# EAGLE design BackPlane (EAGLE 9.6.2)
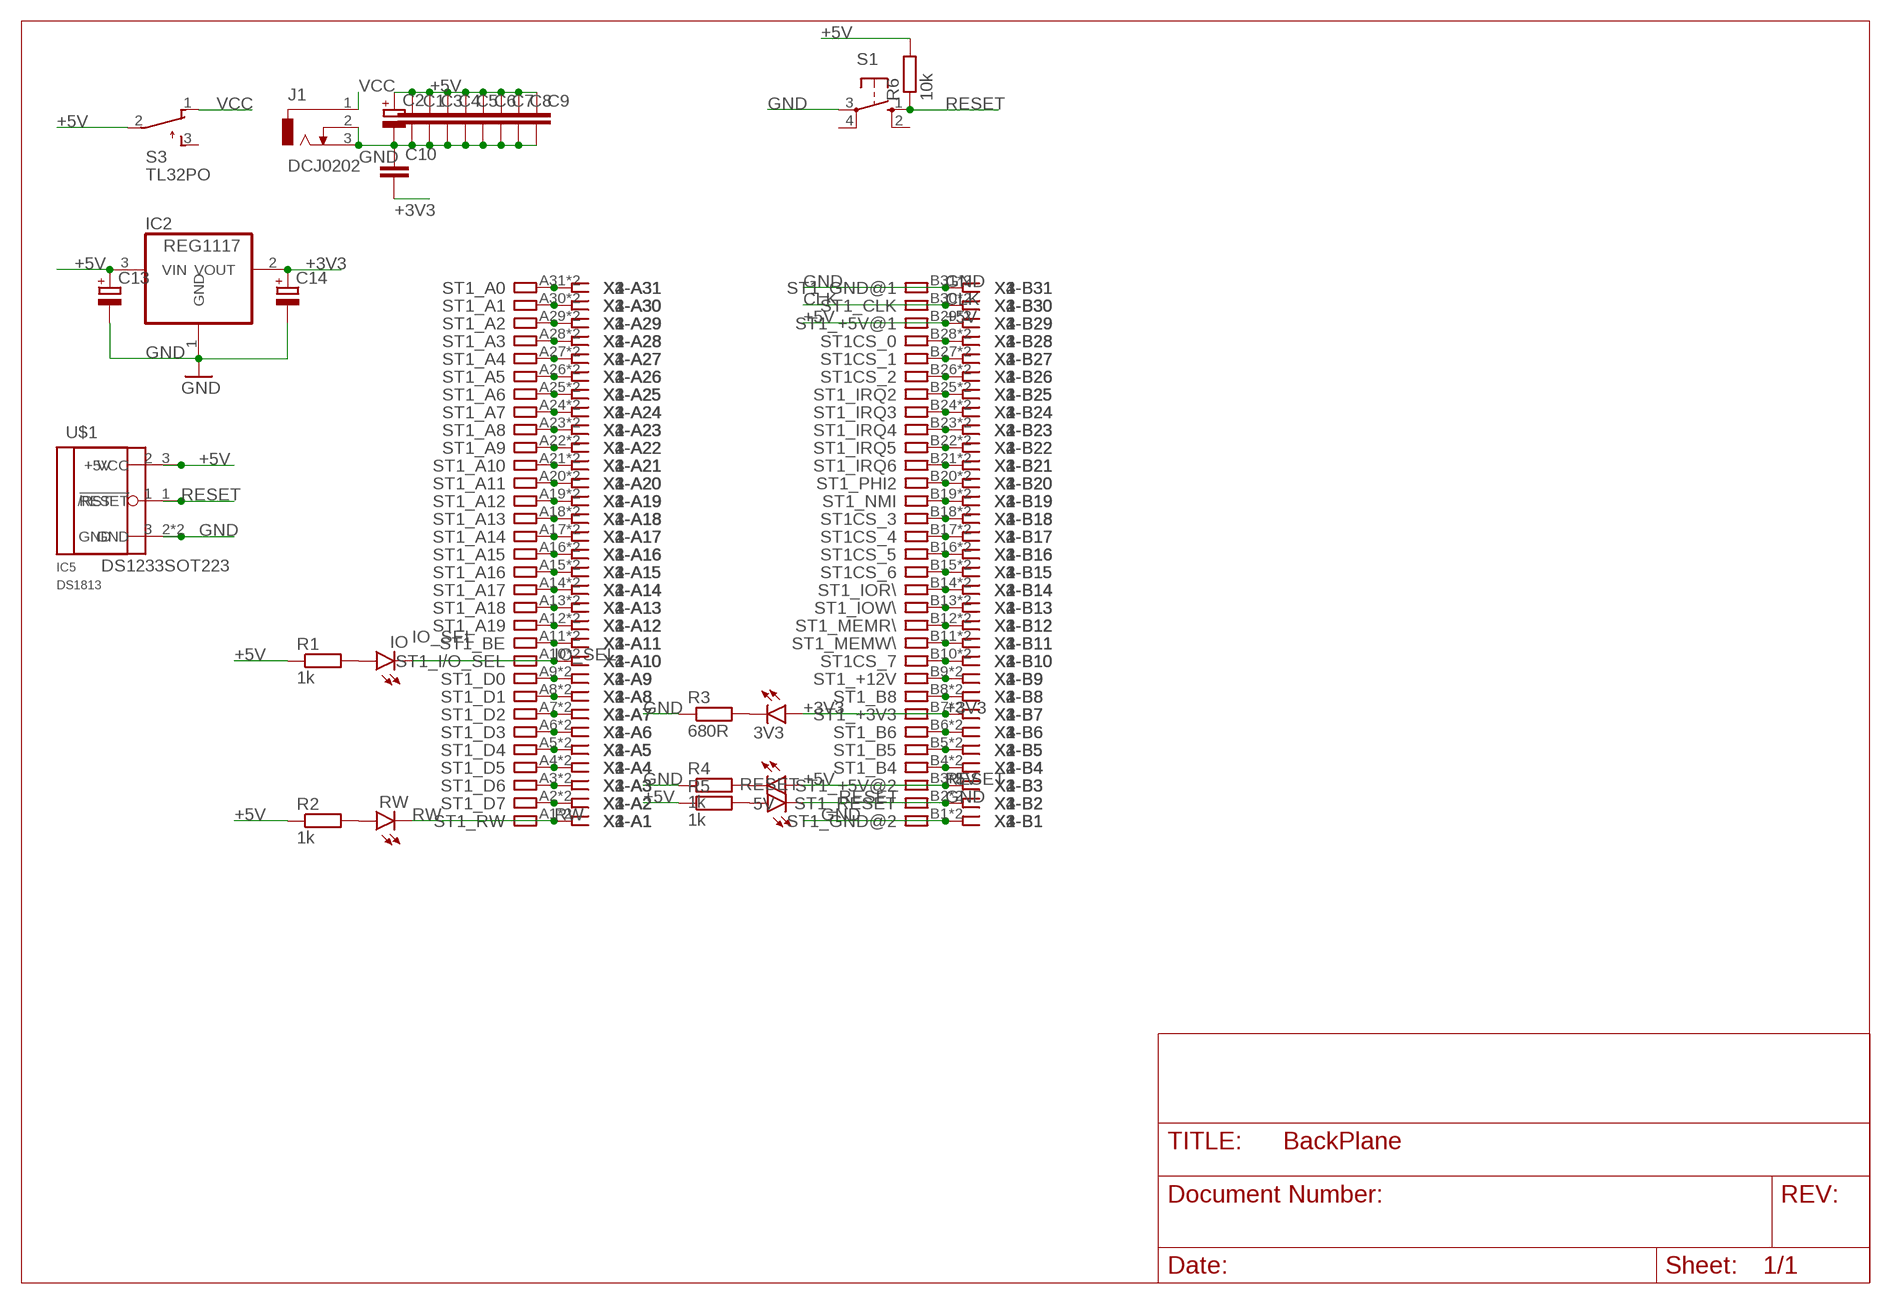
[diagram p0: schematic, sheet 1]

## Parts
3V3  LED3MM  [LED3MM]
5V  LED3MM  [LED3MM]
C1  C-EU050-024X044  [C050-024X044]
C2  CPOL-EUE3.5-8  [E3,5-8]
C3  C-EU050-024X044  [C050-024X044]
C4  C-EU050-024X044  [C050-024X044]
C5  C-EU050-024X044  [C050-024X044]
C6  C-EU050-024X044  [C050-024X044]
C7  C-EU050-024X044  [C050-024X044]
C8  C-EU050-024X044  [C050-024X044]
C9  C-EU050-024X044  [C050-024X044]
C10  C-EU025-024X044  [C025-024X044]
C13  CPOL-EUE2.5-5  [E2,5-5]
C14  CPOL-EUE2.5-5  [E2,5-5]
IC2  REG1117  [SOT223]
IC5  DS1813  [TO-92]
IO  LED3MM  [LED3MM]
J1  DCJ0202  [DCJ0202]
R1  1k  R-EU_0207/7  [0207/7]
R2  1k  R-EU_0207/7  [0207/7]
R3  680R  R-EU_0207/7  [0207/7]
R4  1k  R-EU_0207/7  [0207/7]
R5  1k  R-EU_0207/7  [0207/7]
R6  10k  R-EU_0207/7  [0207/7]
RESET  LED3MM  [LED3MM]
RW  LED3MM  [LED3MM]
S1  10-XX  [B3F-10XX]
S3  TL32PO  [TL3XPO]
ST1  IBM8BIT_ISA  [APP_2X32_DOUBLE]
U$1  DS1233SOT223  [SOT223]
X1  ISA-SLOT  [ISA-8]
X2  ISA-SLOT  [ISA-8]
X3  ISA-SLOT  [ISA-8]
X4  ISA-SLOT  [ISA-8]

## Nets
+3V3: 3V3.A C10.2 C14.+ IC2.2(VOUT) ST1.B7 ST1.B38 X1.B7 X2.B7 X3.B7 X4.B7
+5V: 5V.A C1.1 C2.+ C3.1 C4.1 C5.1 C6.1 C7.1 C8.1 C9.1 C13.+ IC2.3(VIN) IC5.2(+5V) R1.1 R2.1 R5.1 R6.2 S3.2(P) ST1.B3 ST1.B29 ST1.B34 ST1.B60 U$1.3(VCC) X1.B3 X1.B29 X2.B3 X2.B29 X3.B3 X3.B29 X4.B3 X4.B29
CLK: ST1.B30 ST1.B61 X1.B30 X2.B30 X3.B30 X4.B30
GND: C1.2 C2.- C3.2 C4.2 C5.2 C6.2 C7.2 C8.2 C9.2 C10.1 C13.- C14.- IC2.1(GND) IC5.3(GND) J1.2 J1.3 R3.1 R4.1 S1.3(P) ST1.B1 ST1.B31 ST1.B32 ST1.B62 U$1.2(GND) U$1.4(GND) X1.B1 X1.B31 X2.B1 X2.B31 X3.B1 X3.B31 X4.B1 X4.B31
IO_SEL: IO.K(C) ST1.A10 ST1.A41 X1.A10 X2.A10 X3.A10 X4.A10
N$1: IO.A R1.2
N$2: ST1.A2 ST1.A33 X1.A2 X2.A2 X3.A2 X4.A2
N$3: ST1.A3 ST1.A34 X1.A3 X2.A3 X3.A3 X4.A3
N$4: ST1.A4 ST1.A35 X1.A4 X2.A4 X3.A4 X4.A4
N$5: ST1.A5 ST1.A36 X1.A5 X2.A5 X3.A5 X4.A5
N$6: ST1.A6 ST1.A37 X1.A6 X2.A6 X3.A6 X4.A6
N$7: ST1.A7 ST1.A38 X1.A7 X2.A7 X3.A7 X4.A7
N$8: ST1.A8 ST1.A39 X1.A8 X2.A8 X3.A8 X4.A8
N$9: ST1.A9 ST1.A40 X1.A9 X2.A9 X3.A9 X4.A9
N$10: R2.2 RW.A
N$12: ST1.A11 ST1.A42 X1.A11 X2.A11 X3.A11 X4.A11
N$13: ST1.A12 ST1.A43 X1.A12 X2.A12 X3.A12 X4.A12
N$14: ST1.A13 ST1.A44 X1.A13 X2.A13 X3.A13 X4.A13
N$15: ST1.A14 ST1.A45 X1.A14 X2.A14 X3.A14 X4.A14
N$16: ST1.A15 ST1.A46 X1.A15 X2.A15 X3.A15 X4.A15
N$17: ST1.A16 ST1.A47 X1.A16 X2.A16 X3.A16 X4.A16
N$18: ST1.A17 ST1.A48 X1.A17 X2.A17 X3.A17 X4.A17
N$19: ST1.A18 ST1.A49 X1.A18 X2.A18 X3.A18 X4.A18
N$20: ST1.A19 ST1.A50 X1.A19 X2.A19 X3.A19 X4.A19
N$21: ST1.A20 ST1.A51 X1.A20 X2.A20 X3.A20 X4.A20
N$22: ST1.A21 ST1.A52 X1.A21 X2.A21 X3.A21 X4.A21
N$23: ST1.A22 ST1.A53 X1.A22 X2.A22 X3.A22 X4.A22
N$24: ST1.A23 ST1.A54 X1.A23 X2.A23 X3.A23 X4.A23
N$25: ST1.A24 ST1.A55 X1.A24 X2.A24 X3.A24 X4.A24
N$26: ST1.A25 ST1.A56 X1.A25 X2.A25 X3.A25 X4.A25
N$27: ST1.A26 ST1.A57 X1.A26 X2.A26 X3.A26 X4.A26
N$28: ST1.A27 ST1.A58 X1.A27 X2.A27 X3.A27 X4.A27
N$29: ST1.A28 ST1.A59 X1.A28 X2.A28 X3.A28 X4.A28
N$30: ST1.A29 ST1.A60 X1.A29 X2.A29 X3.A29 X4.A29
N$31: ST1.A30 ST1.A61 X1.A30 X2.A30 X3.A30 X4.A30
N$32: ST1.A31 ST1.A62 X1.A31 X2.A31 X3.A31 X4.A31
N$35: ST1.B4 ST1.B35 X1.B4 X2.B4 X3.B4 X4.B4
N$36: ST1.B5 ST1.B36 X1.B5 X2.B5 X3.B5 X4.B5
N$37: ST1.B6 ST1.B37 X1.B6 X2.B6 X3.B6 X4.B6
N$39: ST1.B8 ST1.B39 X1.B8 X2.B8 X3.B8 X4.B8
N$40: ST1.B9 ST1.B40 X1.B9 X2.B9 X3.B9 X4.B9
N$41: ST1.B10 ST1.B41 X1.B10 X2.B10 X3.B10 X4.B10
N$42: ST1.B11 ST1.B42 X1.B11 X2.B11 X3.B11 X4.B11
N$43: ST1.B12 ST1.B43 X1.B12 X2.B12 X3.B12 X4.B12
N$44: ST1.B13 ST1.B44 X1.B13 X2.B13 X3.B13 X4.B13
N$45: ST1.B14 ST1.B45 X1.B14 X2.B14 X3.B14 X4.B14
N$46: ST1.B15 ST1.B46 X1.B15 X2.B15 X3.B15 X4.B15
N$47: ST1.B16 ST1.B47 X1.B16 X2.B16 X3.B16 X4.B16
N$48: ST1.B17 ST1.B48 X1.B17 X2.B17 X3.B17 X4.B17
N$49: ST1.B18 ST1.B49 X1.B18 X2.B18 X3.B18 X4.B18
N$50: ST1.B19 ST1.B50 X1.B19 X2.B19 X3.B19 X4.B19
N$51: ST1.B20 ST1.B51 X1.B20 X2.B20 X3.B20 X4.B20
N$52: ST1.B21 ST1.B52 X1.B21 X2.B21 X3.B21 X4.B21
N$53: ST1.B22 ST1.B53 X1.B22 X2.B22 X3.B22 X4.B22
N$54: ST1.B23 ST1.B54 X1.B23 X2.B23 X3.B23 X4.B23
N$55: ST1.B24 ST1.B55 X1.B24 X2.B24 X3.B24 X4.B24
N$56: ST1.B25 ST1.B56 X1.B25 X2.B25 X3.B25 X4.B25
N$57: ST1.B26 ST1.B57 X1.B26 X2.B26 X3.B26 X4.B26
N$58: ST1.B27 ST1.B58 X1.B27 X2.B27 X3.B27 X4.B27
N$59: ST1.B28 ST1.B59 X1.B28 X2.B28 X3.B28 X4.B28
N$63: 3V3.K(C) R3.2
N$64: 5V.K(C) R4.2
N$68: R5.2 RESET.A
RESET: IC5.1(/RST) R6.1 RESET.K(C) S1.1(S) ST1.B2 ST1.B33 U$1.1(!RESET) X1.B2 X2.B2 X3.B2 X4.B2
RW: RW.K(C) ST1.A1 ST1.A32 X1.A1 X2.A1 X3.A1 X4.A1
VCC: J1.1 S3.1(O)
Unconnected: S1.2(S1) S1.4(P1) S3.3(S)

## Library data of the parts
3V3 5V IO RESET RW = led:LED: LED OSRAM: - CHIPLED LG R971, LG N971, LY N971, LG Q971, LY Q971, LO R971, LY R971 LH N974, LH R974 LS Q976, LO Q976, LY Q976 LO Q996 - Hyper CHIPLED LW Q18S LB Q993, LB Q99A, LB R99A - SideLED LS A670, LO A670, LY A670, LG A670, LP A670 LB A673, LV A673, LT A673, LW A673 LH A674 LY A675 LS A676, LA A676, LO A676, LY A676, LW A676 LS A679, LY A679, LG A679 - Hyper Micro SIDELED® LS Y876, LA Y876, LO Y876, LY Y876 LT Y87S - SmartLED LW L88C, LW L88S LB L89C, LB L89S, LG L890 LS L89K, LO L89K, LY L89K LS L896, LA L896, LO L896, LY L896 - TOPLED LS T670, LO T670, LY T670, LG T670, LP T670 LSG T670, LSP T670, LSY T670, LOP T670, LYG T670 LG T671, LOG T671, LSG T671 LB T673, LV T673, LT T673, LW T673 LH T674 LS T676, LA T676, LO T676, LY T676, LB T676, LH T676, LSB T676, LW T676 LB T67C, LV T67C, LT T67C, LS T67K, LO T67K, LY T67K, LW E67C LS E67B, LA E67B, LO E67B, LY E67B, LB E67C, LV E67C, LT E67C LW T67C LS T679, LY T679, LG T679 LS T770, LO T770, LY T770, LG T770, LP T770 LB T773, LV T773, LT T773, LW T773 LH T774 LS E675, LA E675, LY E675, LS T675 LS T776, LA T776, LO T776, LY T776, LB T776 LHGB T686 LT T68C, LB T68C - Hyper Mini TOPLED® LB M676 - Mini TOPLED Santana® LG M470 LS M47K, LO M47K, LY M47K Source: http://www.osram.convergy.de LUXEON: - LUMILED® LXK2-PW12-R00, LXK2-PW12-S00, LXK2-PW14-U00, LXK2-PW14-V00 LXK2-PM12-R00, LXK2-PM12-S00, LXK2-PM14-U00 LXK2-PE12-Q00, LXK2-PE12-R00, LXK2-PE12-S00, LXK2-PE14-T00, LXK2-PE14-U00 LXK2-PB12-K00, LXK2-PB12-L00, LXK2-PB12-M00, LXK2-PB14-N00, LXK2-PB14-P00, LXK2-PB14-Q00 LXK2-PR12-L00, LXK2-PR12-M00, LXK2-PR14-Q00, LXK2-PR14-R00 LXK2-PD12-Q00, LXK2-PD12-R00, LXK2-PD12-S00 LXK2-PH12-R00, LXK2-PH12-S00 LXK2-PL12-P00, LXK2-PL12-Q00, LXK2-PL12-R00 Source: www.luxeon.com KINGBRIGHT: KA-3528ASYC Source: www.kingbright.com
C1 C3-C10 = rcl:C-EU: CAPACITOR, European symbol; SPICEPREFIX: C
C2 C13 C14 = rcl:CPOL-EU: POLARIZED CAPACITOR, European symbol; SPICEPREFIX: C
IC2 = burr-brown:REG1117: 800mA and 1A Low Dropout (LDO) Positive Regulator 1.8V, 2.5V, 2.85V, 3.3V, 5V, and Adj; MPN: REG1117; OC_FARNELL: 1097566; OC_NEWARK: 14P6981
IC5 = ds1813_revised:DS1813
J1 = con-jack:DCJ0202: DC POWER JACK Source: DCJ0202.pdf; OC_FARNELL: unknown; OC_NEWARK: unknown
R1-R6 = rcl:R-EU_: RESISTOR, European symbol; SPICEPREFIX: R
S1 = switch-omron:10-XX: OMRON SWITCH; MPN: B3F-1000; OC_FARNELL: 176432; OC_NEWARK: 36M3542
S3 = switch:TL32PO: TINY SWITCH ON - MOM Source: http://www2.produktinfo.conrad.com/datenblaetter/700000-724999/705152-da-01-de-Subminiaturschalter_TL_36YO.pdf
ST1 = TiRoRiN_Libs:IBM8BIT_ISA: 8-bit CARD IBM/PC-AT
U$1 = TiRoRiN_Libs:DS1233
X1-X4 = TiRoRiN_Libs:ISA-SLOT: ISA SLOT

## Net classes
0 default: width 0.203 mm, drill 0.66 mm, clearance 0.254 mm
1 power: width 0.203 mm, drill 0.66 mm, clearance 0.254 mm to class 0, clearance 0.381 mm
2 data: width 0.381 mm, drill 0.66 mm, clearance 0.254 mm to class 0, clearance 0.254 mm to class 1, clearance 0.254 mm

## Board
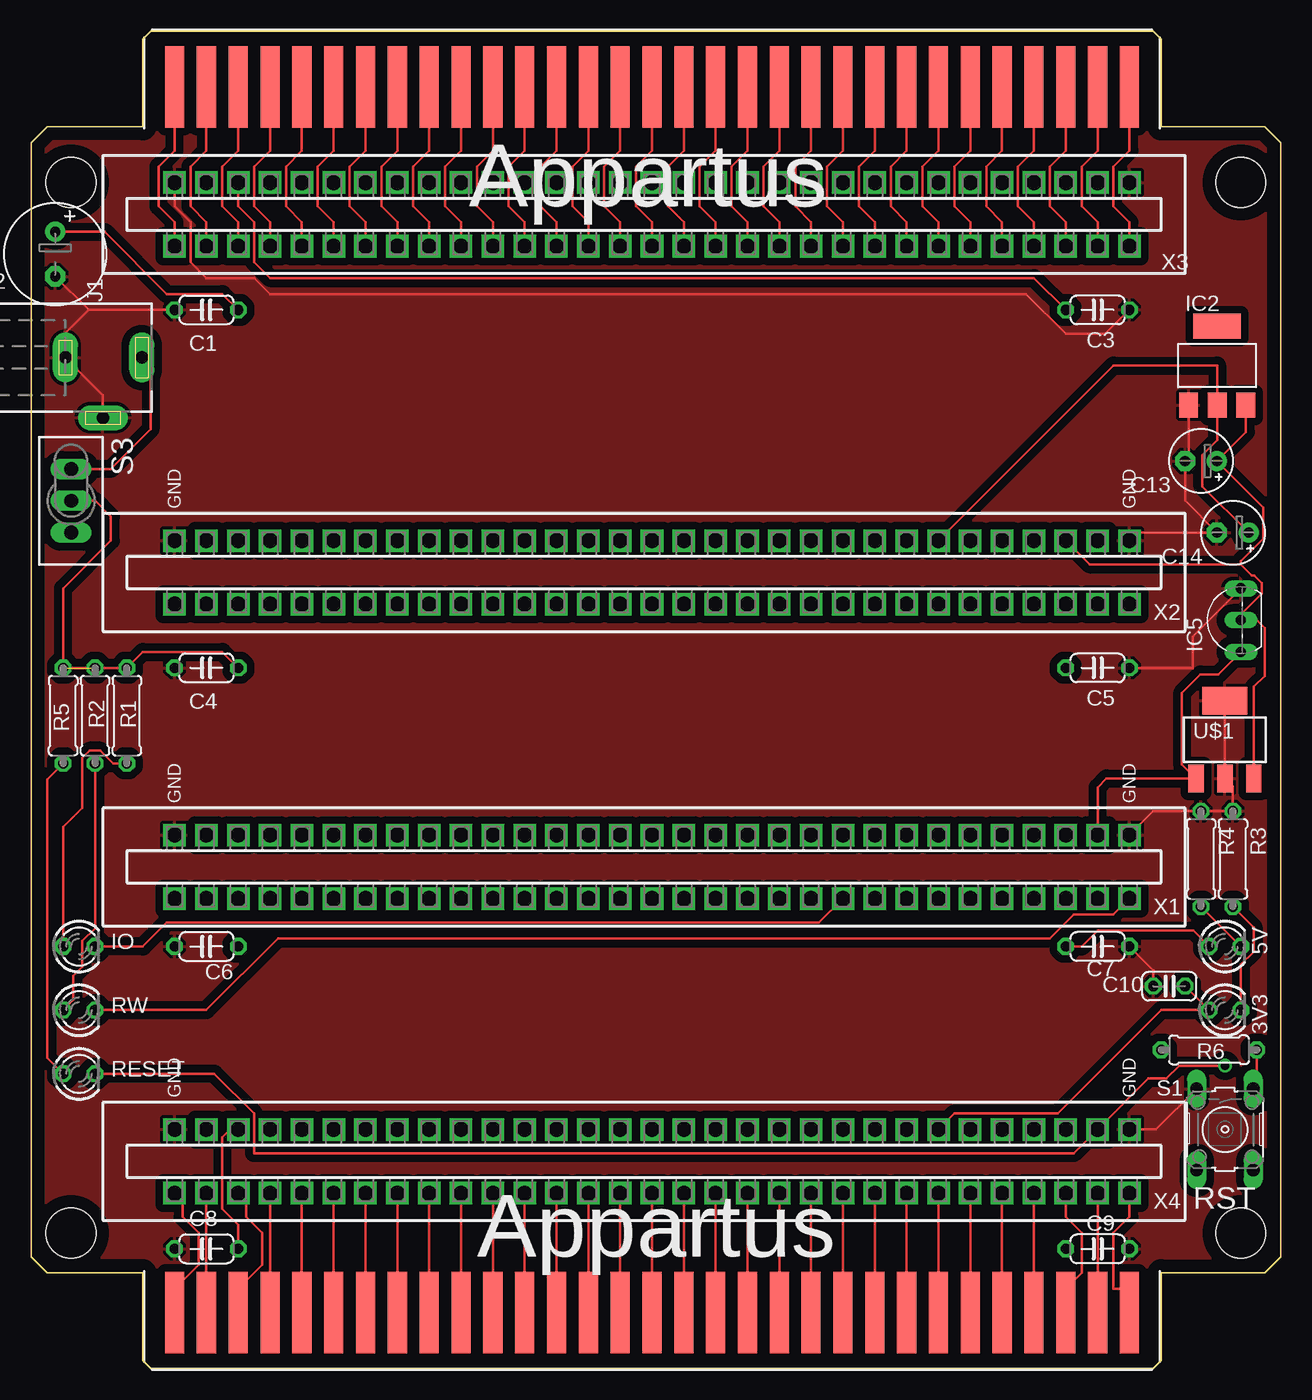
[diagram p1: board, top side]
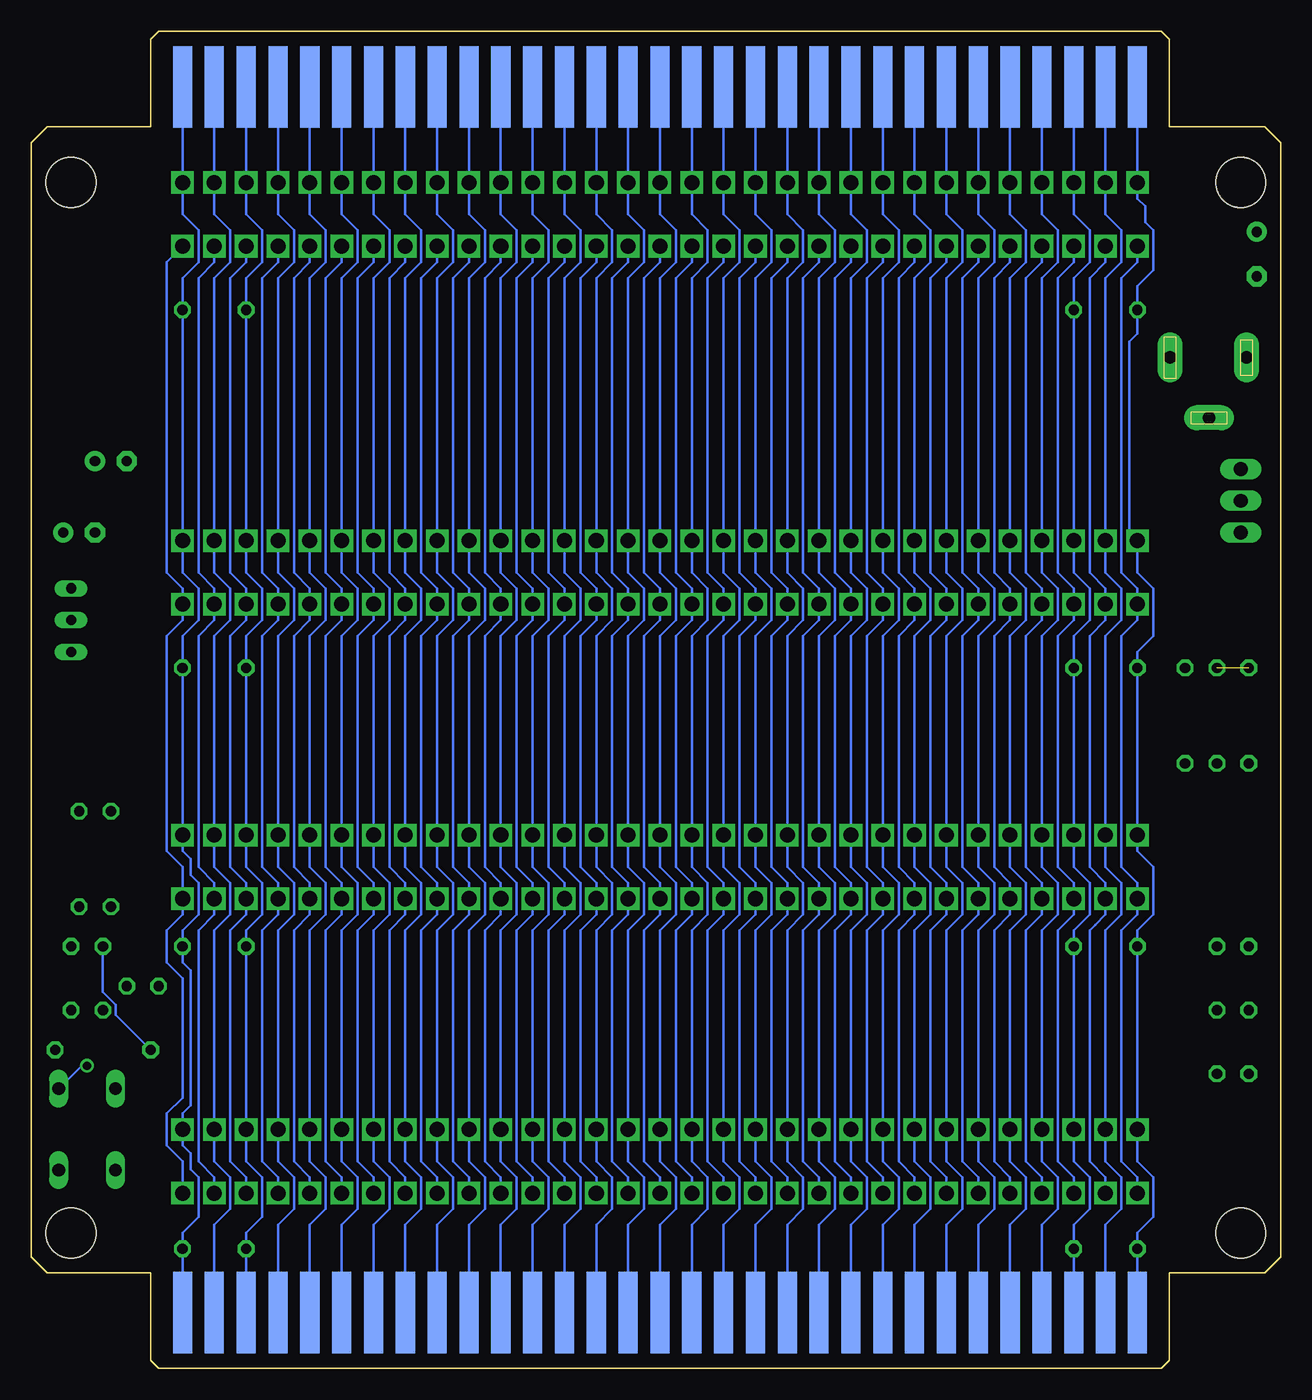
[diagram p2: board, bottom side, seen from below]

Size 99.69 x 106.68 mm. Coordinates in mm from the lower left corner, seen from the top.
Copper layers (1*16): Top 0.035mm / dielectric 1.5mm / Bottom 0.035mm
Design rules "default": minimum track width 6mil, minimum drill 0.35mm, track to track 6mil, track to pad 6mil, pad to pad 6mil, via to via 6mil, smd to smd 6mil, copper to edge 40mil, drill to drill 6mil, minimum pad ring 10mil, minimum via ring 8mil, stop-mask expansion 4mil, vias tented up to drill 0mil, thermal gap 10mil
Holes 4 mm at 3.17,94.61 96.52,94.61 96.52,10.79 3.17,10.79

### Footprints (pad centres in the part's own frame; a part is rotated, then mirrored left to right if it is on the bottom)
LED3MM = drill 0.813 octagon: A -1.27,0; K 1.27,0
C050-024X044 = drill 0.813 octagon: 1 -2.54,0; 2 2.54,0
E3,5-8 = drill 0.813 pad 1.6: + -1.778,0 | drill 0.813 pad 1.6 octagon: - 1.778,0
C025-024X044 = drill 0.813 octagon: 1 -1.27,0; 2 1.27,0
E2,5-5 = drill 0.813 pad 1.6: + -1.27,0 | drill 0.813 pad 1.6 octagon: - 1.27,0
SOT223 = smd 1.499 x 2.007: 1 -2.261,-3.15; 2 0.025,-3.15; 3 2.311,-3.15 | smd 3.81 x 2.007: 4 0,3.15
TO-92 = drill 0.813 long: 1 -2.54,0; 2 0,0; 3 2.54,0
DCJ0202 = drill 1 pad 2 long: 1 0,3.1; 2 4.8,0; 3 0,-3
0207/7 = drill 0.813 octagon: 1 -3.81,0; 2 3.81,0
B3F-10XX = drill 1.016 long: 1 -3.251,2.261; 2 3.251,2.261; 3 -3.251,-2.261; 4 3.251,-2.261
TL3XPO = drill 1.1 pad 1.422 long: 1 -2.54,0; 2 0,0; 3 2.54,0
APP_2X32_DOUBLE = smd 1.524 x 6.477: A1 38.1,-43.18; A2 35.56,-43.18; A3 33.02,-43.18; A4 30.48,-43.18; A5 27.94,-43.18; A6 25.4,-43.18; A7 22.86,-43.18; A8 20.32,-43.18; A9 17.78,-43.18; A10 15.24,-43.18; A11 12.7,-43.18; A12 10.16,-43.18; A13 7.62,-43.18; A14 5.08,-43.18; A15 2.54,-43.18; A16 0,-43.18; A17 -2.54,-43.18; A18 -5.08,-43.18; A19 -7.62,-43.18; A20 -10.16,-43.18; A21 -12.7,-43.18; A22 -15.24,-43.18; A23 -17.78,-43.18; A24 -20.32,-43.18; A25 -22.86,-43.18; A26 -25.4,-43.18; A27 -27.94,-43.18; A28 -30.48,-43.18; A29 -33.02,-43.18; A30 -35.56,-43.18; A31 -38.1,-43.18; A32 38.1,54.61; A33 35.56,54.61; A34 33.02,54.61; A35 30.48,54.61; A36 27.94,54.61; A37 25.4,54.61; A38 22.86,54.61; A39 20.32,54.61; A40 17.78,54.61; A41 15.24,54.61; A42 12.7,54.61; A43 10.16,54.61; A44 7.62,54.61; A45 5.08,54.61; A46 2.54,54.61; A47 0,54.61; A48 -2.54,54.61; A49 -5.08,54.61; A50 -7.62,54.61; A51 -10.16,54.61; A52 -12.7,54.61; A53 -15.24,54.61; A54 -17.78,54.61; A55 -20.32,54.61; A56 -22.86,54.61; A57 -25.4,54.61; A58 -27.94,54.61; A59 -30.48,54.61; A60 -33.02,54.61; A61 -35.56,54.61; A62 -38.1,54.61 | smd 1.524 x 6.477 bottom: B1 38.1,-43.18; B2 35.56,-43.18; B3 33.02,-43.18; B4 30.48,-43.18; B5 27.94,-43.18; B6 25.4,-43.18; B7 22.86,-43.18; B8 20.32,-43.18; B9 17.78,-43.18; B10 15.24,-43.18; B11 12.7,-43.18; B12 10.16,-43.18; B13 7.62,-43.18; B14 5.08,-43.18; B15 2.54,-43.18; B16 0,-43.18; B17 -2.54,-43.18; B18 -5.08,-43.18; B19 -7.62,-43.18; B20 -10.16,-43.18; B21 -12.7,-43.18; B22 -15.24,-43.18; B23 -17.78,-43.18; B24 -20.32,-43.18; B25 -22.86,-43.18; B26 -25.4,-43.18; B27 -27.94,-43.18; B28 -30.48,-43.18; B29 -33.02,-43.18; B30 -35.56,-43.18; B31 -38.1,-43.18; B32 38.1,54.61; B33 35.56,54.61; B34 33.02,54.61; B35 30.48,54.61; B36 27.94,54.61; B37 25.4,54.61; B38 22.86,54.61; B39 20.32,54.61; B40 17.78,54.61; B41 15.24,54.61; B42 12.7,54.61; B43 10.16,54.61; B44 7.62,54.61; B45 5.08,54.61; B46 2.54,54.61; B47 0,54.61; B48 -2.54,54.61; B49 -5.08,54.61; B50 -7.62,54.61; B51 -10.16,54.61; B52 -12.7,54.61; B53 -15.24,54.61; B54 -17.78,54.61; B55 -20.32,54.61; B56 -22.86,54.61; B57 -25.4,54.61; B58 -27.94,54.61; B59 -30.48,54.61; B60 -33.02,54.61; B61 -35.56,54.61; B62 -38.1,54.61
SOT223' = smd 1.219 x 2.235: 1 -2.311,-3.099; 2 0,-3.099; 3 2.311,-3.099 | smd 3.6 x 2.2: 4 0,3.099
ISA-8 = drill 1.2 pad 1.778 square: A1 40.64,-2.54; A2 38.1,-2.54; A3 35.56,-2.54; A4 33.02,-2.54; A5 30.48,-2.54; A6 27.94,-2.54; A7 25.4,-2.54; A8 22.86,-2.54; A9 20.32,-2.54; A10 17.78,-2.54; A11 15.24,-2.54; A12 12.7,-2.54; A13 10.16,-2.54; A14 7.62,-2.54; A15 5.08,-2.54; A16 2.54,-2.54; A17 0,-2.54; A18 -2.54,-2.54; A19 -5.08,-2.54; A20 -7.62,-2.54; A21 -10.16,-2.54; A22 -12.7,-2.54; A23 -15.24,-2.54; A24 -17.78,-2.54; A25 -20.32,-2.54; A26 -22.86,-2.54; A27 -25.4,-2.54; A28 -27.94,-2.54; A29 -30.48,-2.54; A30 -33.02,-2.54; A31 -35.56,-2.54; B1 40.64,2.54; B2 38.1,2.54; B3 35.56,2.54; B4 33.02,2.54; B5 30.48,2.54; B6 27.94,2.54; B7 25.4,2.54; B8 22.86,2.54; B9 20.32,2.54; B10 17.78,2.54; B11 15.24,2.54; B12 12.7,2.54; B13 10.16,2.54; B14 7.62,2.54; B15 5.08,2.54; B16 2.54,2.54; B17 0,2.54; B18 -2.54,2.54; B19 -5.08,2.54; B20 -7.62,2.54; B21 -10.16,2.54; B22 -12.7,2.54; B23 -15.24,2.54; B24 -17.78,2.54; B25 -20.32,2.54; B26 -22.86,2.54; B27 -25.4,2.54; B28 -27.94,2.54; B29 -30.48,2.54; B30 -33.02,2.54; B31 -35.56,2.54

### Placement (x,y rotation side)
3V3  95.25,28.57 0 top
5V  95.25,33.66 0 top
C1  13.97,84.45 180 top
C2  1.9,88.9 270 top
C3  85.09,84.45 0 top
C4  13.97,55.88 180 top
C5  85.09,55.88 0 top
C6  13.97,33.66 180 top
C7  85.09,33.66 0 top
C8  13.97,9.52 180 top
C9  85.09,9.52 0 top
C10  90.81,30.48 0 top
C13  93.34,72.39 180 top
C14  95.88,66.67 180 top
IC2  94.62,80.01 0 top
IC5  96.52,59.69 90 top
IO  3.81,33.66 0 top
J1  5.71,80.64 270 top
R1  7.62,52.07 270 top
R2  5.08,52.07 270 top
R3  95.88,40.64 270 top
R4  93.34,40.64 270 top
R5  2.54,52.07 270 top
R6  93.98,25.4 180 top
RESET  3.81,23.49 0 top
RW  3.81,28.57 0 top
S1  95.25,19.05 270 top
S3  3.17,69.22 270 top
ST1  49.53,47.62 0 top
U$1  DS1233SOT223  [SOT223']  95.25,50.16 0 top
X1  46.99,40 0 top
X2  46.99,63.5 0 top
X3  46.99,92.08 0 top
X4  46.99,16.51 0 top

### Tracks (layer width: path | path; a pad name or v marks a point on that pad's centre or on a via)
+3V3
  Top 0.203: X4.B7 73.66,20.32 81.91,20.32 90.17,28.57 3V3.A C10.2 | X2.B7 86.36,80.01 94.62,80.01 94.64,79.98 IC2.2 94.64,74.05 93.46,72.87 93.46,70.37 C14.+
  Bottom 0.203: ST1.B7 72.39,11.43 71.12,12.7 71.12,15.24 72.39,16.51 X4.B7 72.39,34.92 71.12,36.2 71.12,38.73 72.39,40 X1.B7 72.39,58.42 71.12,59.69 71.12,62.23 72.39,63.5 X2.B7 72.39,87 71.12,88.27 71.12,90.8 72.39,92.08 X3.B7 ST1.B38
+5V  (1 unrouted)
  Top 0.203: 5V.A 92.71,34.92 85.09,34.92 83.82,33.66 C7.1 | C8.1 16.51,11.43 15.24,12.7 15.24,18.41 15.88,19.05 X4.B29 | C4.1 15.24,57.15 8.89,57.15 R1.1 R5.1 2.54,62.23 6.35,66.04 6.35,67.94 5.08,69.22 S3.2 | IC2.3 96.93,74.7 C13.+ 98.31,68.69 98.31,66.2 96.52,64.41 96.52,64.13 | X2.B3 84.46,64.13 96.52,64.13 | 96.52,64.13 97.41,63.25 97.6,63.25 98.2,62.65 98.2,61.81 96.52,60.13 IC5.2 97.79,59.69 98.43,59.05 98.43,55.24 97.56,54.38 U$1.3 | C2.+ 5.84,90.68 10.79,85.72 15.24,85.72 C1.1 | X3.B29 16.51,92.71 17.78,91.44 17.78,88.27 19.05,87 80.01,87 C3.1
  Bottom 0.203: ST1.B3 C9.1 82.55,10.79 81.28,12.06 81.28,15.24 82.55,16.51 X4.B3 C7.1 82.55,34.92 81.28,36.2 81.28,38.73 82.55,40 X1.B3 C5.1 82.55,58.42 81.28,59.69 81.28,62.23 82.55,63.5 X2.B3 C3.1 82.55,87 81.28,88.27 81.28,90.8 82.55,92.08 X3.B3 ST1.B34 | ST1.B29 16.51,11.43 15.24,12.7 15.24,15.24 16.51,16.51 X4.B29 C6.1 16.51,34.92 15.24,36.2 15.24,38.73 16.51,40 X1.B29 C4.1 16.51,58.42 15.24,59.69 15.24,62.23 16.51,63.5 X2.B29 C1.1 16.51,87 15.24,88.27 15.24,90.8 16.51,92.08 X3.B29 ST1.B60 | R6.2 92.96,28.19 92.96,29 93.98,30.01 5V.A
CLK
  Bottom 0.203: ST1.B30 13.97,11.43 12.7,12.7 12.7,15.24 13.97,16.51 X4.B30 13.97,34.92 12.7,36.2 12.7,38.73 13.97,40 X1.B30 13.97,58.42 12.7,59.69 12.7,62.23 13.97,63.5 X2.B30 13.97,87 12.7,88.27 12.7,90.8 13.97,92.08 X3.B30 ST1.B61
GND
  Top 0.203: C7.2 89.53,31.75 C10.1 | S1.3 89.74,19.05 X4.B1 | IC2.1 92.35,72.67 C13.- 92.07,69.22 C14.- 88.26,66.67 X2.B1 | X1.B1 89.53,44.45 R4.1 R3.1 95.88,46.43 U$1.2 U$1.4 | C5.2 92.63,55.88 92.67,55.84 92.67,58.38 IC5.3 | X3.B31 11.43,92.71 12.7,91.44 12.7,88.27 13.97,87 17.78,87 19.05,85.72 79.38,85.72 82.55,82.55 85.72,82.55 C3.2 | C1.2 4.57,84.45 | 4.57,84.45 C2.- | 4.57,84.45 2.71,82.6 J1.3 5.71,77.64 J1.2
  Bottom 0.203: ST1.B31 C8.2 11.43,10.79 10.16,12.06 10.16,15.24 11.43,16.51 X4.B31 C6.2 11.43,34.92 10.16,36.2 10.16,40 11.43,41.27 X1.B31 C4.2 11.43,57.15 10.16,58.42 10.16,62.23 11.43,63.5 X2.B31 12.06,66.67 12.06,81.91 11.43,82.55 C1.2 11.43,86.36 10.16,87.63 10.16,90.8 10.79,91.44 10.79,92.71 11.43,93.34 X3.B31 ST1.B62 | X2.B1 87.63,63.5 86.36,62.23 86.36,59.69 87.63,58.42 C5.2 X1.B1 87.63,41.27 87,40.64 87,39.37 86.36,38.73 86.36,36.2 87.63,34.92 C7.2 87.63,32.38 87,31.75 87,20.95 87.63,20.32 X4.B1 87.63,17.78 87,17.14 87,15.87 86.36,15.24 86.36,12.06 87.63,10.79 C9.2 ST1.B1 | X2.B1 87.63,66.67 | X2.B1 C3.2 87.63,87 86.36,88.27 86.36,90.8 87.63,92.08 X3.B1 ST1.B32
  pour Top (isolate 0.61): -0.64,99.69 102.87,99.69 102.87,5.71 -0.64,5.71
IO_SEL
  Top 0.203: IO.K 8.89,33.66 10.79,35.56 62.87,35.56 X1.A10 | X4.A10 ST1.A10 | X3.A10 64.77,91.44 63.5,92.71 63.5,95.88 64.77,97.16 ST1.A41
  Bottom 0.203: X4.A10 64.77,15.24 66.04,16.51 66.04,34.92 64.77,36.2 X1.A10 64.77,38.73 66.04,40 66.04,58.42 64.77,59.69 X2.A10 64.77,62.23 66.04,63.5 66.04,87 64.77,88.27 X3.A10
N$1
  Top 0.203: IO.A 2.54,43.18 4.06,44.7 4.06,48.68 4.66,49.28 5.5,49.28 6.52,48.26 R1.2
N$2
  Top 0.203: X4.A2 ST1.A2 | X3.A2 85.09,91.44 83.82,92.71 83.82,95.88 85.09,97.16 ST1.A33
  Bottom 0.203: X4.A2 85.09,15.24 86.36,16.51 86.36,34.92 85.09,36.2 X1.A2 85.09,38.73 86.36,40 86.36,58.42 85.09,59.69 X2.A2 85.09,62.23 86.36,63.5 86.36,87 85.09,88.27 X3.A2
N$3
  Top 0.203: ST1.A3 82.55,6.35 83.82,7.62 83.82,10.79 82.55,12.06 X4.A3 | X3.A3 82.55,91.44 81.28,92.71 81.28,95.88 82.55,97.16 ST1.A34
  Bottom 0.203: X4.A3 82.55,15.24 83.82,16.51 83.82,34.92 82.55,36.2 X1.A3 82.55,38.73 83.82,40 83.82,58.42 82.55,59.69 X2.A3 82.55,62.23 83.82,63.5 83.82,87 82.55,88.27 X3.A3
N$4
  Top 0.203: X4.A4 ST1.A4 | X3.A4 80.01,91.44 78.74,92.71 78.74,95.88 80.01,97.16 ST1.A35
  Bottom 0.203: X4.A4 80.01,15.24 81.28,16.51 81.28,34.92 80.01,36.2 X1.A4 80.01,38.73 81.28,40 81.28,58.42 80.01,59.69 X2.A4 80.01,62.23 81.28,63.5 81.28,87 80.01,88.27 X3.A4
N$5
  Top 0.203: X4.A5 ST1.A5 | X3.A5 77.47,91.44 76.2,92.71 76.2,95.88 77.47,97.16 ST1.A36
  Bottom 0.203: X4.A5 77.47,15.24 78.74,16.51 78.74,34.92 77.47,36.2 X1.A5 77.47,38.73 78.74,40 78.74,58.42 77.47,59.69 X2.A5 77.47,62.23 78.74,63.5 78.74,87 77.47,88.27 X3.A5
N$6
  Top 0.203: X4.A6 ST1.A6 | X3.A6 74.93,91.44 73.66,92.71 73.66,95.88 74.93,97.16 ST1.A37
  Bottom 0.203: X4.A6 74.93,15.24 76.2,16.51 76.2,34.92 74.93,36.2 X1.A6 74.93,38.73 76.2,40 76.2,58.42 74.93,59.69 X2.A6 74.93,62.23 76.2,63.5 76.2,87 74.93,88.27 X3.A6
N$7
  Top 0.203: X4.A7 ST1.A7 | X3.A7 72.39,91.44 71.12,92.71 71.12,95.88 72.39,97.16 ST1.A38
  Bottom 0.203: X4.A7 72.39,15.24 73.66,16.51 73.66,34.92 72.39,36.2 X1.A7 72.39,38.73 73.66,40 73.66,58.42 72.39,59.69 X2.A7 72.39,62.23 73.66,63.5 73.66,87 72.39,88.27 X3.A7
N$8
  Top 0.203: X4.A8 ST1.A8 | X3.A8 69.85,91.44 68.58,92.71 68.58,95.88 69.85,97.16 ST1.A39
  Bottom 0.203: X4.A8 69.85,15.24 71.12,16.51 71.12,34.92 69.85,36.2 X1.A8 69.85,38.73 71.12,40 71.12,58.42 69.85,59.69 X2.A8 69.85,62.23 71.12,63.5 71.12,87 69.85,88.27 X3.A8
N$9
  Top 0.203: X4.A9 ST1.A9 | X3.A9 67.31,91.44 66.04,92.71 66.04,95.88 67.31,97.16 ST1.A40
  Bottom 0.203: X4.A9 67.31,15.24 68.58,16.51 68.58,34.92 67.31,36.2 X1.A9 67.31,38.73 68.58,40 68.58,58.42 67.31,59.69 X2.A9 67.31,62.23 68.58,63.5 68.58,87 67.31,88.27 X3.A9
N$10
  Top 0.203: RW.A 3.35,29.39 3.35,31.3 4.06,32.02 4.06,34.08 5.08,35.09 R2.2
N$12
  Top 0.203: X4.A11 ST1.A11 | X3.A11 62.23,91.44 60.96,92.71 60.96,95.88 62.23,97.16 ST1.A42
  Bottom 0.203: X4.A11 62.23,15.24 63.5,16.51 63.5,34.92 62.23,36.2 X1.A11 62.23,38.73 63.5,40 63.5,58.42 62.23,59.69 X2.A11 62.23,62.23 63.5,63.5 63.5,87 62.23,88.27 X3.A11
N$13
  Top 0.203: X4.A12 ST1.A12 | X3.A12 59.69,91.44 58.42,92.71 58.42,95.88 59.69,97.16 ST1.A43
  Bottom 0.203: X4.A12 59.69,15.24 60.96,16.51 60.96,34.92 59.69,36.2 X1.A12 59.69,38.73 60.96,40 60.96,58.42 59.69,59.69 X2.A12 59.69,62.23 60.96,63.5 60.96,87 59.69,88.27 X3.A12
N$14
  Top 0.203: X4.A13 ST1.A13 | X3.A13 57.15,91.44 55.88,92.71 55.88,95.88 57.15,97.16 ST1.A44
  Bottom 0.203: X4.A13 57.15,15.24 58.42,16.51 58.42,34.92 57.15,36.2 X1.A13 57.15,38.73 58.42,40 58.42,58.42 57.15,59.69 X2.A13 57.15,62.23 58.42,63.5 58.42,87 57.15,88.27 X3.A13
N$15
  Top 0.203: X4.A14 ST1.A14 | X3.A14 54.61,91.44 53.34,92.71 53.34,95.88 54.61,97.16 ST1.A45
  Bottom 0.203: X4.A14 54.61,15.24 55.88,16.51 55.88,34.92 54.61,36.2 X1.A14 54.61,38.73 55.88,40 55.88,58.42 54.61,59.69 X2.A14 54.61,62.23 55.88,63.5 55.88,87 54.61,88.27 X3.A14
N$16
  Top 0.203: X4.A15 ST1.A15 | X3.A15 52.07,91.44 50.8,92.71 50.8,95.88 52.07,97.16 ST1.A46
  Bottom 0.203: X4.A15 52.07,15.24 53.34,16.51 53.34,34.92 52.07,36.2 X1.A15 52.07,38.73 53.34,40 53.34,58.42 52.07,59.69 X2.A15 52.07,62.23 53.34,63.5 53.34,87 52.07,88.27 X3.A15
N$17
  Top 0.203: X4.A16 ST1.A16 | X3.A16 49.53,91.44 48.26,92.71 48.26,95.88 49.53,97.16 ST1.A47
  Bottom 0.203: X4.A16 49.53,15.24 50.8,16.51 50.8,34.92 49.53,36.2 X1.A16 49.53,38.73 50.8,40 50.8,58.42 49.53,59.69 X2.A16 49.53,62.23 50.8,63.5 50.8,87 49.53,88.27 X3.A16
N$18
  Top 0.203: X4.A17 ST1.A17 | X3.A17 46.99,91.44 45.72,92.71 45.72,95.88 46.99,97.16 ST1.A48
  Bottom 0.203: X4.A17 46.99,15.24 48.26,16.51 48.26,34.92 46.99,36.2 X1.A17 46.99,38.73 48.26,40 48.26,58.42 46.99,59.69 X2.A17 46.99,62.23 48.26,63.5 48.26,87 46.99,88.27 X3.A17
N$19
  Top 0.203: X4.A18 ST1.A18 | X3.A18 44.45,91.44 43.18,92.71 43.18,95.88 44.45,97.16 ST1.A49
  Bottom 0.203: X4.A18 44.45,15.24 45.72,16.51 45.72,34.92 44.45,36.2 X1.A18 44.45,38.73 45.72,40 45.72,58.42 44.45,59.69 X2.A18 44.45,62.23 45.72,63.5 45.72,87 44.45,88.27 X3.A18
N$20
  Top 0.203: X4.A19 ST1.A19 | X3.A19 41.91,91.44 40.64,92.71 40.64,95.88 41.91,97.16 ST1.A50
  Bottom 0.203: X4.A19 41.91,15.24 43.18,16.51 43.18,34.92 41.91,36.2 X1.A19 41.91,38.73 43.18,40 43.18,58.42 41.91,59.69 X2.A19 41.91,62.23 43.18,63.5 43.18,87 41.91,88.27 X3.A19
N$21
  Top 0.203: X4.A20 ST1.A20 | X3.A20 39.37,91.44 38.1,92.71 38.1,95.88 39.37,97.16 ST1.A51
  Bottom 0.203: X4.A20 39.37,15.24 40.64,16.51 40.64,34.92 39.37,36.2 X1.A20 39.37,38.73 40.64,40 40.64,58.42 39.37,59.69 X2.A20 39.37,62.23 40.64,63.5 40.64,87 39.37,88.27 X3.A20
N$22
  Top 0.203: X4.A21 ST1.A21 | X3.A21 36.83,91.44 35.56,92.71 35.56,95.88 36.83,97.16 ST1.A52
  Bottom 0.203: X4.A21 36.83,15.24 38.1,16.51 38.1,34.92 36.83,36.2 X1.A21 36.83,38.73 38.1,40 38.1,58.42 36.83,59.69 X2.A21 36.83,62.23 38.1,63.5 38.1,87 36.83,88.27 X3.A21
N$23
  Top 0.203: X4.A22 ST1.A22 | X3.A22 34.29,91.44 33.02,92.71 33.02,95.88 34.29,97.16 ST1.A53
  Bottom 0.203: X4.A22 34.29,15.24 35.56,16.51 35.56,34.92 34.29,36.2 X1.A22 34.29,38.73 35.56,40 35.56,58.42 34.29,59.69 X2.A22 34.29,62.23 35.56,63.5 35.56,87 34.29,88.27 X3.A22
N$24
  Top 0.203: X4.A23 ST1.A23 | X3.A23 31.75,91.44 30.48,92.71 30.48,95.88 31.75,97.16 ST1.A54
  Bottom 0.203: X4.A23 31.75,15.24 33.02,16.51 33.02,34.92 31.75,36.2 X1.A23 31.75,38.73 33.02,40 33.02,58.42 31.75,59.69 X2.A23 31.75,62.23 33.02,63.5 33.02,87 31.75,88.27 X3.A23
N$25
  Top 0.203: X4.A24 ST1.A24 | X3.A24 29.21,91.44 27.94,92.71 27.94,95.88 29.21,97.16 ST1.A55
  Bottom 0.203: X4.A24 29.21,15.24 30.48,16.51 30.48,34.92 29.21,36.2 X1.A24 29.21,38.73 30.48,40 30.48,58.42 29.21,59.69 X2.A24 29.21,62.23 30.48,63.5 30.48,87 29.21,88.27 X3.A24
N$26
  Top 0.203: X4.A25 ST1.A25 | X3.A25 26.67,91.44 25.4,92.71 25.4,95.88 26.67,97.16 ST1.A56
  Bottom 0.203: X4.A25 26.67,15.24 27.94,16.51 27.94,34.92 26.67,36.2 X1.A25 26.67,38.73 27.94,40 27.94,58.42 26.67,59.69 X2.A25 26.67,62.23 27.94,63.5 27.94,87 26.67,88.27 X3.A25
N$27
  Top 0.203: X4.A26 ST1.A26 | X3.A26 24.13,91.44 22.86,92.71 22.86,95.88 24.13,97.16 ST1.A57
  Bottom 0.203: X4.A26 24.13,15.24 25.4,16.51 25.4,34.92 24.13,36.2 X1.A26 24.13,38.73 25.4,40 25.4,58.42 24.13,59.69 X2.A26 24.13,62.23 25.4,63.5 25.4,87 24.13,88.27 X3.A26
N$28
  Top 0.203: X4.A27 ST1.A27 | X3.A27 21.59,91.44 20.32,92.71 20.32,95.88 21.59,97.16 ST1.A58
  Bottom 0.203: X4.A27 21.59,15.24 22.86,16.51 22.86,34.92 21.59,36.2 X1.A27 21.59,38.73 22.86,40 22.86,58.42 21.59,59.69 X2.A27 21.59,62.23 22.86,63.5 22.86,87 21.59,88.27 X3.A27
N$29
  Top 0.203: X4.A28 ST1.A28 | X3.A28 19.05,91.44 17.78,92.71 17.78,95.88 19.05,97.16 ST1.A59
  Bottom 0.203: X4.A28 19.05,15.24 20.32,16.51 20.32,34.92 19.05,36.2 X1.A28 19.05,38.73 20.32,40 20.32,58.42 19.05,59.69 X2.A28 19.05,62.23 20.32,63.5 20.32,87 19.05,88.27 X3.A28
N$30
  Top 0.203: ST1.A29 16.51,6.98 17.14,6.98 18.41,8.25 18.41,10.79 17.14,12.06 17.14,13.97 X4.A29 | X3.A29 16.51,91.44 15.24,92.71 15.24,95.88 16.51,97.16 ST1.A60
  Bottom 0.203: X4.A29 16.51,15.24 17.78,16.51 17.78,34.92 16.51,36.2 X1.A29 16.51,38.73 17.78,40 17.78,58.42 16.51,59.69 X2.A29 16.51,62.23 17.78,63.5 17.78,87 16.51,88.27 X3.A29
N$31
  Top 0.203: X4.A30 ST1.A30 | X3.A30 13.97,91.44 12.7,92.71 12.7,95.88 13.97,97.16 ST1.A61
  Bottom 0.203: X4.A30 13.97,15.24 15.24,16.51 15.24,34.91 14.78,35.37 14.78,35.38 13.97,36.2 X1.A30 13.97,38.73 15.24,40 15.24,58.42 13.97,59.69 X2.A30 13.97,62.23 15.24,63.5 15.24,87 13.97,88.27 X3.A30
N$32
  Top 0.203: ST1.A31 11.43,6.98 12.06,6.98 13.33,8.25 13.33,10.79 12.06,12.06 12.06,13.97 X4.A31 | X3.A31 11.43,91.44 10.16,92.71 10.16,95.88 11.43,97.16 ST1.A62
  Bottom 0.203: X4.A31 11.43,15.24 12.7,16.51 12.7,34.92 11.43,36.2 X1.A31 11.43,38.73 12.7,40 12.7,58.42 11.43,59.69 X2.A31 11.43,62.23 12.7,63.5 12.7,87 11.43,88.27 X3.A31
N$35
  Bottom 0.203: ST1.B4 80.01,11.43 78.74,12.7 78.74,15.24 80.01,16.51 X4.B4 80.01,34.92 78.74,36.2 78.74,38.73 80.01,40 X1.B4 80.01,58.42 78.74,59.69 78.74,62.23 80.01,63.5 X2.B4 80.01,87 78.74,88.27 78.74,90.8 80.01,92.08 X3.B4 ST1.B35
N$36
  Bottom 0.203: ST1.B5 77.47,11.43 76.2,12.7 76.2,15.24 77.47,16.51 X4.B5 77.47,34.92 76.2,36.2 76.2,38.73 77.47,40 X1.B5 77.47,58.42 76.2,59.69 76.2,62.23 77.47,63.5 X2.B5 77.47,87 76.2,88.27 76.2,90.8 77.47,92.08 X3.B5 ST1.B36
N$37
  Bottom 0.203: ST1.B6 74.93,11.43 73.66,12.7 73.66,15.24 74.93,16.51 X4.B6 74.93,34.92 73.66,36.2 73.66,38.73 74.93,40 X1.B6 74.93,58.42 73.66,59.69 73.66,62.23 74.93,63.5 X2.B6 74.93,87 73.66,88.27 73.66,90.8 74.93,92.08 X3.B6 ST1.B37
N$39
  Bottom 0.203: ST1.B8 69.85,11.43 68.58,12.7 68.58,15.24 69.85,16.51 X4.B8 69.85,34.92 68.58,36.2 68.58,38.73 69.85,40 X1.B8 69.85,58.42 68.58,59.69 68.58,62.23 69.85,63.5 X2.B8 69.85,87 68.58,88.27 68.58,90.8 69.85,92.08 X3.B8 ST1.B39
N$40
  Bottom 0.203: ST1.B9 67.31,11.43 66.04,12.7 66.04,15.24 67.31,16.51 X4.B9 67.31,34.92 66.04,36.2 66.04,38.73 67.31,40 X1.B9 67.31,58.42 66.04,59.69 66.04,62.23 67.31,63.5 X2.B9 67.31,87 66.04,88.27 66.04,90.8 67.31,92.08 X3.B9 ST1.B40
N$41
  Bottom 0.203: ST1.B10 64.77,11.43 63.5,12.7 63.5,15.24 64.77,16.51 X4.B10 64.77,34.92 63.5,36.2 63.5,38.73 64.77,40 X1.B10 64.77,58.42 63.5,59.69 63.5,62.23 64.77,63.5 X2.B10 64.77,87 63.5,88.27 63.5,90.8 64.77,92.08 X3.B10 ST1.B41
N$42
  Bottom 0.203: ST1.B11 62.23,11.43 60.96,12.7 60.96,15.24 62.23,16.51 X4.B11 62.23,34.92 60.96,36.2 60.96,38.73 62.23,40 X1.B11 62.23,58.42 60.96,59.69 60.96,62.23 62.23,63.5 X2.B11 62.23,87 60.96,88.27 60.96,90.8 62.23,92.08 X3.B11 ST1.B42
N$43
  Bottom 0.203: ST1.B12 59.69,11.43 58.42,12.7 58.42,15.24 59.69,16.51 X4.B12 59.69,34.92 58.42,36.2 58.42,38.73 59.69,40 X1.B12 59.69,58.42 58.42,59.69 58.42,62.23 59.69,63.5 X2.B12 59.69,87 58.42,88.27 58.42,90.8 59.69,92.08 X3.B12 ST1.B43
N$44
  Bottom 0.203: ST1.B13 57.15,11.43 55.88,12.7 55.88,15.24 57.15,16.51 X4.B13 57.15,34.92 55.88,36.2 55.88,38.73 57.15,40 X1.B13 57.15,58.42 55.88,59.69 55.88,62.23 57.15,63.5 X2.B13 57.15,87 55.88,88.27 55.88,90.8 57.15,92.08 X3.B13 ST1.B44
N$45
  Bottom 0.203: ST1.B14 54.61,11.43 53.34,12.7 53.34,15.24 54.61,16.51 X4.B14 54.61,34.92 53.34,36.2 53.34,38.73 54.61,40 X1.B14 54.61,58.42 53.34,59.69 53.34,62.23 54.61,63.5 X2.B14 54.61,87 53.34,88.27 53.34,90.8 54.61,92.08 X3.B14 ST1.B45
N$46
  Bottom 0.203: ST1.B15 52.07,11.43 50.8,12.7 50.8,15.24 52.07,16.51 X4.B15 52.07,34.92 50.8,36.2 50.8,38.73 52.07,40 X1.B15 52.07,58.42 50.8,59.69 50.8,62.23 52.07,63.5 X2.B15 52.07,87 50.8,88.27 50.8,90.8 52.07,92.08 X3.B15 ST1.B46
N$47
  Bottom 0.203: ST1.B16 49.53,11.43 48.26,12.7 48.26,15.24 49.53,16.51 X4.B16 49.53,34.92 48.26,36.2 48.26,38.73 49.53,40 X1.B16 49.53,58.42 48.26,59.69 48.26,62.23 49.53,63.5 X2.B16 49.53,87 48.26,88.27 48.26,90.8 49.53,92.08 X3.B16 ST1.B47
N$48
  Bottom 0.203: ST1.B17 46.99,11.43 45.72,12.7 45.72,15.24 46.99,16.51 X4.B17 46.99,34.92 45.72,36.2 45.72,38.73 46.99,40 X1.B17 46.99,58.42 45.72,59.69 45.72,62.23 46.99,63.5 X2.B17 46.99,87 45.72,88.27 45.72,90.8 46.99,92.08 X3.B17 ST1.B48
N$49
  Bottom 0.203: ST1.B18 44.45,11.43 43.18,12.7 43.18,15.24 44.45,16.51 X4.B18 44.45,34.92 43.18,36.2 43.18,38.73 44.45,40 X1.B18 44.45,58.42 43.18,59.69 43.18,62.23 44.45,63.5 X2.B18 44.45,87 43.18,88.27 43.18,90.8 44.45,92.08 X3.B18 ST1.B49
N$50
  Bottom 0.203: ST1.B19 41.91,11.43 40.64,12.7 40.64,15.24 41.91,16.51 X4.B19 41.91,34.92 40.64,36.2 40.64,38.73 41.91,40 X1.B19 41.91,58.42 40.64,59.69 40.64,62.23 41.91,63.5 X2.B19 41.91,87 40.64,88.27 40.64,90.8 41.91,92.08 X3.B19 ST1.B50
N$51
  Bottom 0.203: ST1.B20 39.37,11.43 38.1,12.7 38.1,15.24 39.37,16.51 X4.B20 39.37,34.92 38.1,36.2 38.1,38.73 39.37,40 X1.B20 39.37,58.42 38.1,59.69 38.1,62.23 39.37,63.5 X2.B20 39.37,87 38.1,88.27 38.1,90.8 39.37,92.08 X3.B20 ST1.B51
N$52
  Bottom 0.203: ST1.B21 36.83,11.43 35.56,12.7 35.56,15.24 36.83,16.51 X4.B21 36.83,34.92 35.56,36.2 35.56,38.73 36.83,40 X1.B21 36.83,58.42 35.56,59.69 35.56,62.23 36.83,63.5 X2.B21 36.83,87 35.56,88.27 35.56,90.8 36.83,92.08 X3.B21 ST1.B52
N$53
  Bottom 0.203: ST1.B22 34.29,11.43 33.02,12.7 33.02,15.24 34.29,16.51 X4.B22 34.29,34.92 33.02,36.2 33.02,38.73 34.29,40 X1.B22 34.29,58.42 33.02,59.69 33.02,62.23 34.29,63.5 X2.B22 34.29,87 33.02,88.27 33.02,90.8 34.29,92.08 X3.B22 ST1.B53
N$54
  Bottom 0.203: ST1.B23 31.75,11.43 30.48,12.7 30.48,15.24 31.75,16.51 X4.B23 31.75,34.92 30.48,36.2 30.48,38.73 31.75,40 X1.B23 31.75,58.42 30.48,59.69 30.48,62.23 31.75,63.5 X2.B23 31.75,87 30.48,88.27 30.48,90.8 31.75,92.08 X3.B23 ST1.B54
N$55
  Bottom 0.203: ST1.B24 29.21,11.43 27.94,12.7 27.94,15.24 29.21,16.51 X4.B24 29.21,34.92 27.94,36.2 27.94,38.73 29.21,40 X1.B24 29.21,58.42 27.94,59.69 27.94,62.23 29.21,63.5 X2.B24 29.21,87 27.94,88.27 27.94,90.8 29.21,92.08 X3.B24 ST1.B55
N$56
  Bottom 0.203: ST1.B25 26.67,11.43 25.4,12.7 25.4,15.24 26.67,16.51 X4.B25 26.67,34.92 25.4,36.2 25.4,38.73 26.67,40 X1.B25 26.67,58.42 25.4,59.69 25.4,62.23 26.67,63.5 X2.B25 26.67,87 25.4,88.27 25.4,90.8 26.67,92.08 X3.B25 ST1.B56
N$57
  Bottom 0.203: ST1.B26 24.13,11.43 22.86,12.7 22.86,15.24 24.13,16.51 X4.B26 24.13,34.92 22.86,36.2 22.86,38.73 24.13,40 X1.B26 24.13,58.42 22.86,59.69 22.86,62.23 24.13,63.5 X2.B26 24.13,87 22.86,88.27 22.86,90.8 24.13,92.08 X3.B26 ST1.B57
N$58
  Bottom 0.203: ST1.B27 21.59,11.43 20.32,12.7 20.32,15.24 21.59,16.51 X4.B27 21.59,34.92 20.32,36.2 20.32,38.73 21.59,40 X1.B27 21.59,58.42 20.32,59.69 20.32,62.23 21.59,63.5 X2.B27 21.59,87 20.32,88.27 20.32,90.8 21.59,92.08 X3.B27 ST1.B58
N$59
  Bottom 0.203: ST1.B28 19.05,11.43 17.78,12.7 17.78,15.24 19.05,16.51 X4.B28 19.05,34.92 17.78,36.2 17.78,38.73 19.05,40 X1.B28 19.05,58.42 17.78,59.69 17.78,62.23 19.05,63.5 X2.B28 19.05,87 17.78,88.27 17.78,90.8 19.05,92.08 X3.B28 ST1.B59
N$63
  Top 0.203: 3V3.K 96.52,32.22 97.54,33.23 97.54,35.18 R3.2
N$64
  Top 0.203: R4.2 5V.K
N$68
  Top 0.203: R5.2 1.27,46.99 1.27,24.76 RESET.A
RESET  (via drill 0.66)
  Top 0.203: RESET.K 14.6,23.49 17.78,20.32 17.78,17.14 83.19,17.14 84.46,18.41 84.46,19.05 X4.B2 89.15,23.11 90.59,23.11 91.61,24.13 v95.25,24.13 | R6.1 97.79,22.58 S1.1 | X1.B2 85.09,46.35 85.8,47.07 U$1.1 91.82,48.18 91.82,53.88 93.3,55.35 94.72,55.35 IC5.1
  Bottom 0.203: ST1.B2 85.09,11.43 83.82,12.7 83.82,15.24 85.09,16.51 X4.B2 85.09,34.92 83.82,36.2 83.82,38.73 85.09,40 X1.B2 85.09,58.42 83.82,59.69 83.82,62.23 85.09,63.5 X2.B2 85.09,87 83.82,88.27 83.82,90.8 85.09,92.08 X3.B2 ST1.B33 | S1.1 95.68,24.13 v95.25,24.13
RW
  Top 0.203: X4.A1 87.63,12.06 86.36,10.79 86.36,6.35 87.63,6.35 ST1.A1 | X1.A1 86.36,36.2 83.19,36.2 81.28,34.29 19.68,34.29 13.97,28.57 RW.K | X3.A1 87.63,91.44 86.36,92.71 86.36,95.88 87.63,97.16 ST1.A32
  Bottom 0.203: X4.A1 87.63,16.51 88.9,17.78 88.9,20.32 87.63,21.59 87.63,31.11 88.9,32.38 88.9,34.92 87.63,36.2 X1.A1 87.63,40 88.9,41.27 88.9,58.42 87.63,59.69 X2.A1 87.63,62.23 88.9,63.5 88.9,88.27 X3.A1
VCC
  Top 0.203: J1.1 9.52,79.94 9.52,74.93 6.35,71.75 S3.1

### Text on the board
tNames: GND | GND | GND | GND | GND | GND | RST